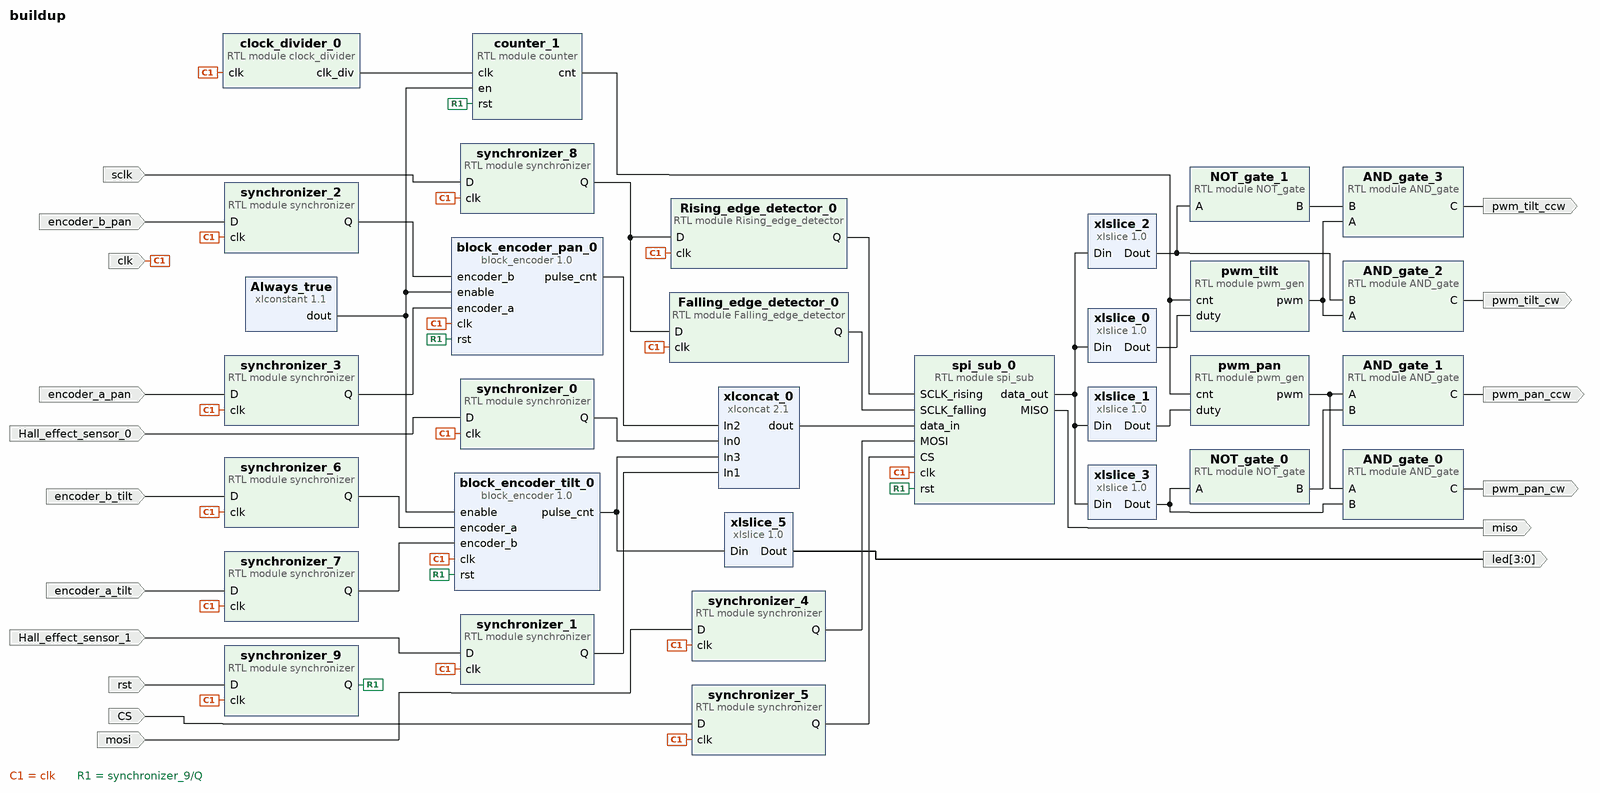
[diagram p0: block diagram of the top level]
# Vivado block design buildup, xc7z020clg400-1, Vivado 2023.2
create_bd_design buildup

create_bd_port -dir I CS
create_bd_port -dir I -type clk clk
create_bd_port -dir I rst
create_bd_port -dir I -type rst mosi
create_bd_port -dir O pwm_pan_cw
create_bd_port -dir I encoder_a_tilt
create_bd_port -dir I encoder_b_tilt
create_bd_port -dir I -type clk sclk
create_bd_port -dir O miso
create_bd_port -dir I encoder_a_pan
create_bd_port -dir I encoder_b_pan
create_bd_port -dir I Hall_effect_sensor_0
create_bd_port -dir I Hall_effect_sensor_1
create_bd_port -dir O pwm_tilt_cw
create_bd_port -dir O pwm_pan_ccw
create_bd_port -dir O pwm_tilt_ccw
create_bd_port -dir O -from 3 -to 0 led

create_bd_cell -type ip -vlnv xilinx.com:ip:xlconstant:1.1 Always_true
create_bd_cell -type module -reference clock_divider clock_divider_0
set_property -dict {CONFIG.n_bits 20} [get_bd_cells clock_divider_0]
create_bd_cell -type ip -vlnv xilinx.com:ip:xlconcat:2.1 xlconcat_0
set_property -dict {CONFIG.IN2_WIDTH 9 CONFIG.IN3_WIDTH 9 CONFIG.NUM_PORTS 4} [get_bd_cells xlconcat_0]
create_bd_cell -type ip -vlnv xilinx.com:ip:xlslice:1.0 xlslice_0
set_property -dict {CONFIG.DIN_FROM 7 CONFIG.DIN_TO 0 CONFIG.DIN_WIDTH 20} [get_bd_cells xlslice_0]
create_bd_cell -type ip -vlnv xilinx.com:ip:xlslice:1.0 xlslice_1
set_property -dict {CONFIG.DIN_FROM 15 CONFIG.DIN_TO 8 CONFIG.DIN_WIDTH 20} [get_bd_cells xlslice_1]
create_bd_cell -type module -reference counter counter_1
set_property -dict {CONFIG.n_bits 8} [get_bd_cells counter_1]
create_bd_cell -type ip -vlnv xilinx.com:ip:xlslice:1.0 xlslice_2
set_property -dict {CONFIG.DIN_FROM 16 CONFIG.DIN_TO 16 CONFIG.DIN_WIDTH 20} [get_bd_cells xlslice_2]
create_bd_cell -type ip -vlnv xilinx.com:ip:xlslice:1.0 xlslice_3
set_property -dict {CONFIG.DIN_FROM 17 CONFIG.DIN_TO 17 CONFIG.DIN_WIDTH 20} [get_bd_cells xlslice_3]
create_bd_cell -type module -reference pwm_gen pwm_pan
set_property -dict {CONFIG.n_bits 8} [get_bd_cells pwm_pan]
create_bd_cell -type module -reference pwm_gen pwm_tilt
set_property -dict {CONFIG.n_bits 8} [get_bd_cells pwm_tilt]
create_bd_cell -type module -reference AND_gate AND_gate_0
create_bd_cell -type module -reference AND_gate AND_gate_1
create_bd_cell -type module -reference AND_gate AND_gate_2
create_bd_cell -type module -reference AND_gate AND_gate_3
create_bd_cell -type module -reference NOT_gate NOT_gate_0
create_bd_cell -type module -reference NOT_gate NOT_gate_1
create_bd_cell -type module -reference spi_sub spi_sub_0
set_property -dict {CONFIG.n_bits 20} [get_bd_cells spi_sub_0]
create_bd_cell -type module -reference synchronizer synchronizer_0
create_bd_cell -type module -reference synchronizer synchronizer_1
create_bd_cell -type module -reference synchronizer synchronizer_2
create_bd_cell -type module -reference synchronizer synchronizer_3
create_bd_cell -type module -reference synchronizer synchronizer_4
create_bd_cell -type module -reference synchronizer synchronizer_5
create_bd_cell -type module -reference synchronizer synchronizer_6
create_bd_cell -type module -reference synchronizer synchronizer_7
create_bd_cell -type module -reference synchronizer synchronizer_8
create_bd_cell -type module -reference synchronizer synchronizer_9
create_bd_cell -type module -reference Rising_edge_detector Rising_edge_detector_0
create_bd_cell -type module -reference Falling_edge_detector Falling_edge_detector_0
create_bd_cell -type ip -vlnv xilinx.com:ip:xlslice:1.0 xlslice_5
set_property -dict {CONFIG.DIN_FROM 3 CONFIG.DIN_WIDTH 9} [get_bd_cells xlslice_5]
create_bd_cell -type ip -vlnv xilinx.com:user:block_encoder:1.0 block_encoder_pan_0
create_bd_cell -type ip -vlnv xilinx.com:user:block_encoder:1.0 block_encoder_tilt_0

# ---- connections ----

connect_bd_net [get_bd_pins AND_gate_0/C] [get_bd_ports pwm_pan_cw]
connect_bd_net [get_bd_pins AND_gate_1/C] [get_bd_ports pwm_pan_ccw]
connect_bd_net [get_bd_pins AND_gate_2/C] [get_bd_ports pwm_tilt_cw]
connect_bd_net [get_bd_pins AND_gate_3/C] [get_bd_ports pwm_tilt_ccw]
connect_bd_net [get_bd_ports CS] [get_bd_pins synchronizer_5/D]
connect_bd_net [get_bd_pins Falling_edge_detector_0/Q] [get_bd_pins spi_sub_0/SCLK_falling]
connect_bd_net -net Hall_effect_sensor_0_1 [get_bd_ports Hall_effect_sensor_0] [get_bd_pins synchronizer_0/D]
connect_bd_net -net Hall_effect_sensor_1_1 [get_bd_ports Hall_effect_sensor_1] [get_bd_pins synchronizer_1/D]
connect_bd_net [get_bd_pins NOT_gate_0/B] [get_bd_pins AND_gate_1/B]
connect_bd_net [get_bd_pins NOT_gate_1/B] [get_bd_pins AND_gate_3/B]
connect_bd_net [get_bd_pins Rising_edge_detector_0/Q] [get_bd_pins spi_sub_0/SCLK_rising]
connect_bd_net -net SPI_0_SPI_out [get_bd_pins spi_sub_0/data_out] \
  [get_bd_pins xlslice_1/Din] [get_bd_pins xlslice_0/Din] [get_bd_pins xlslice_3/Din] [get_bd_pins xlslice_2/Din]
connect_bd_net [get_bd_pins block_encoder_pan_0/pulse_cnt] [get_bd_pins xlconcat_0/In2]
connect_bd_net -net block_encoder_tilt_pulse_cnt [get_bd_pins block_encoder_tilt_0/pulse_cnt] [get_bd_pins xlconcat_0/In3] [get_bd_pins xlslice_5/Din]
connect_bd_net [get_bd_ports clk] \
  [get_bd_pins block_encoder_pan_0/clk] [get_bd_pins block_encoder_tilt_0/clk] [get_bd_pins clock_divider_0/clk] \
  [get_bd_pins spi_sub_0/clk] [get_bd_pins synchronizer_8/clk] [get_bd_pins synchronizer_9/clk] \
  [get_bd_pins synchronizer_0/clk] [get_bd_pins synchronizer_1/clk] [get_bd_pins synchronizer_2/clk] \
  [get_bd_pins synchronizer_3/clk] [get_bd_pins synchronizer_4/clk] [get_bd_pins synchronizer_5/clk] \
  [get_bd_pins synchronizer_6/clk] [get_bd_pins synchronizer_7/clk] [get_bd_pins Rising_edge_detector_0/clk] \
  [get_bd_pins Falling_edge_detector_0/clk]
connect_bd_net [get_bd_pins clock_divider_0/clk_div] [get_bd_pins counter_1/clk]
connect_bd_net [get_bd_pins counter_1/cnt] [get_bd_pins pwm_pan/cnt] [get_bd_pins pwm_tilt/cnt]
connect_bd_net [get_bd_ports encoder_a_pan] [get_bd_pins synchronizer_3/D]
connect_bd_net [get_bd_ports encoder_a_tilt] [get_bd_pins synchronizer_7/D]
connect_bd_net [get_bd_ports encoder_b_pan] [get_bd_pins synchronizer_2/D]
connect_bd_net [get_bd_ports encoder_b_tilt] [get_bd_pins synchronizer_6/D]
connect_bd_net [get_bd_ports mosi] [get_bd_pins synchronizer_4/D]
connect_bd_net [get_bd_pins pwm_pan/pwm] [get_bd_pins AND_gate_0/A] [get_bd_pins AND_gate_1/A]
connect_bd_net -net pwm_tilt_ccw_pwm [get_bd_pins pwm_tilt/pwm] [get_bd_pins AND_gate_2/A] [get_bd_pins AND_gate_3/A]
connect_bd_net [get_bd_ports rst] [get_bd_pins synchronizer_9/D]
connect_bd_net [get_bd_ports sclk] [get_bd_pins synchronizer_8/D]
connect_bd_net [get_bd_pins spi_sub_0/MISO] [get_bd_ports miso]
connect_bd_net [get_bd_pins synchronizer_0/Q] [get_bd_pins xlconcat_0/In0]
connect_bd_net [get_bd_pins synchronizer_1/Q] [get_bd_pins xlconcat_0/In1]
connect_bd_net [get_bd_pins synchronizer_2/Q] [get_bd_pins block_encoder_pan_0/encoder_b]
connect_bd_net [get_bd_pins synchronizer_3/Q] [get_bd_pins block_encoder_pan_0/encoder_a]
connect_bd_net [get_bd_pins synchronizer_4/Q] [get_bd_pins spi_sub_0/MOSI]
connect_bd_net [get_bd_pins synchronizer_5/Q] [get_bd_pins spi_sub_0/CS]
connect_bd_net [get_bd_pins synchronizer_6/Q] [get_bd_pins block_encoder_tilt_0/encoder_a]
connect_bd_net [get_bd_pins synchronizer_7/Q] [get_bd_pins block_encoder_tilt_0/encoder_b]
connect_bd_net [get_bd_pins synchronizer_8/Q] [get_bd_pins Rising_edge_detector_0/D] [get_bd_pins Falling_edge_detector_0/D]
connect_bd_net [get_bd_pins synchronizer_9/Q] \
  [get_bd_pins block_encoder_pan_0/rst] [get_bd_pins block_encoder_tilt_0/rst] [get_bd_pins counter_1/rst] \
  [get_bd_pins spi_sub_0/rst]
connect_bd_net [get_bd_pins xlconcat_0/dout] [get_bd_pins spi_sub_0/data_in]
connect_bd_net -net xlconstant_1_dout [get_bd_pins Always_true/dout] \
  [get_bd_pins block_encoder_pan_0/enable] [get_bd_pins block_encoder_tilt_0/enable] [get_bd_pins counter_1/en]
connect_bd_net [get_bd_pins xlslice_0/Dout] [get_bd_pins pwm_tilt/duty]
connect_bd_net [get_bd_pins xlslice_1/Dout] [get_bd_pins pwm_pan/duty]
connect_bd_net [get_bd_pins xlslice_2/Dout] [get_bd_pins AND_gate_2/B] [get_bd_pins NOT_gate_1/A]
connect_bd_net [get_bd_pins xlslice_3/Dout] [get_bd_pins AND_gate_0/B] [get_bd_pins NOT_gate_0/A]
connect_bd_net [get_bd_pins xlslice_5/Dout] [get_bd_ports led]

validate_bd_design
save_bd_design
